# Altium schematic sheet InputSection.SchDoc: INPUT CAP,TVS, PI FILTER
size 420 x 297 mm; Revision: 1.0; SheetNumber: 2
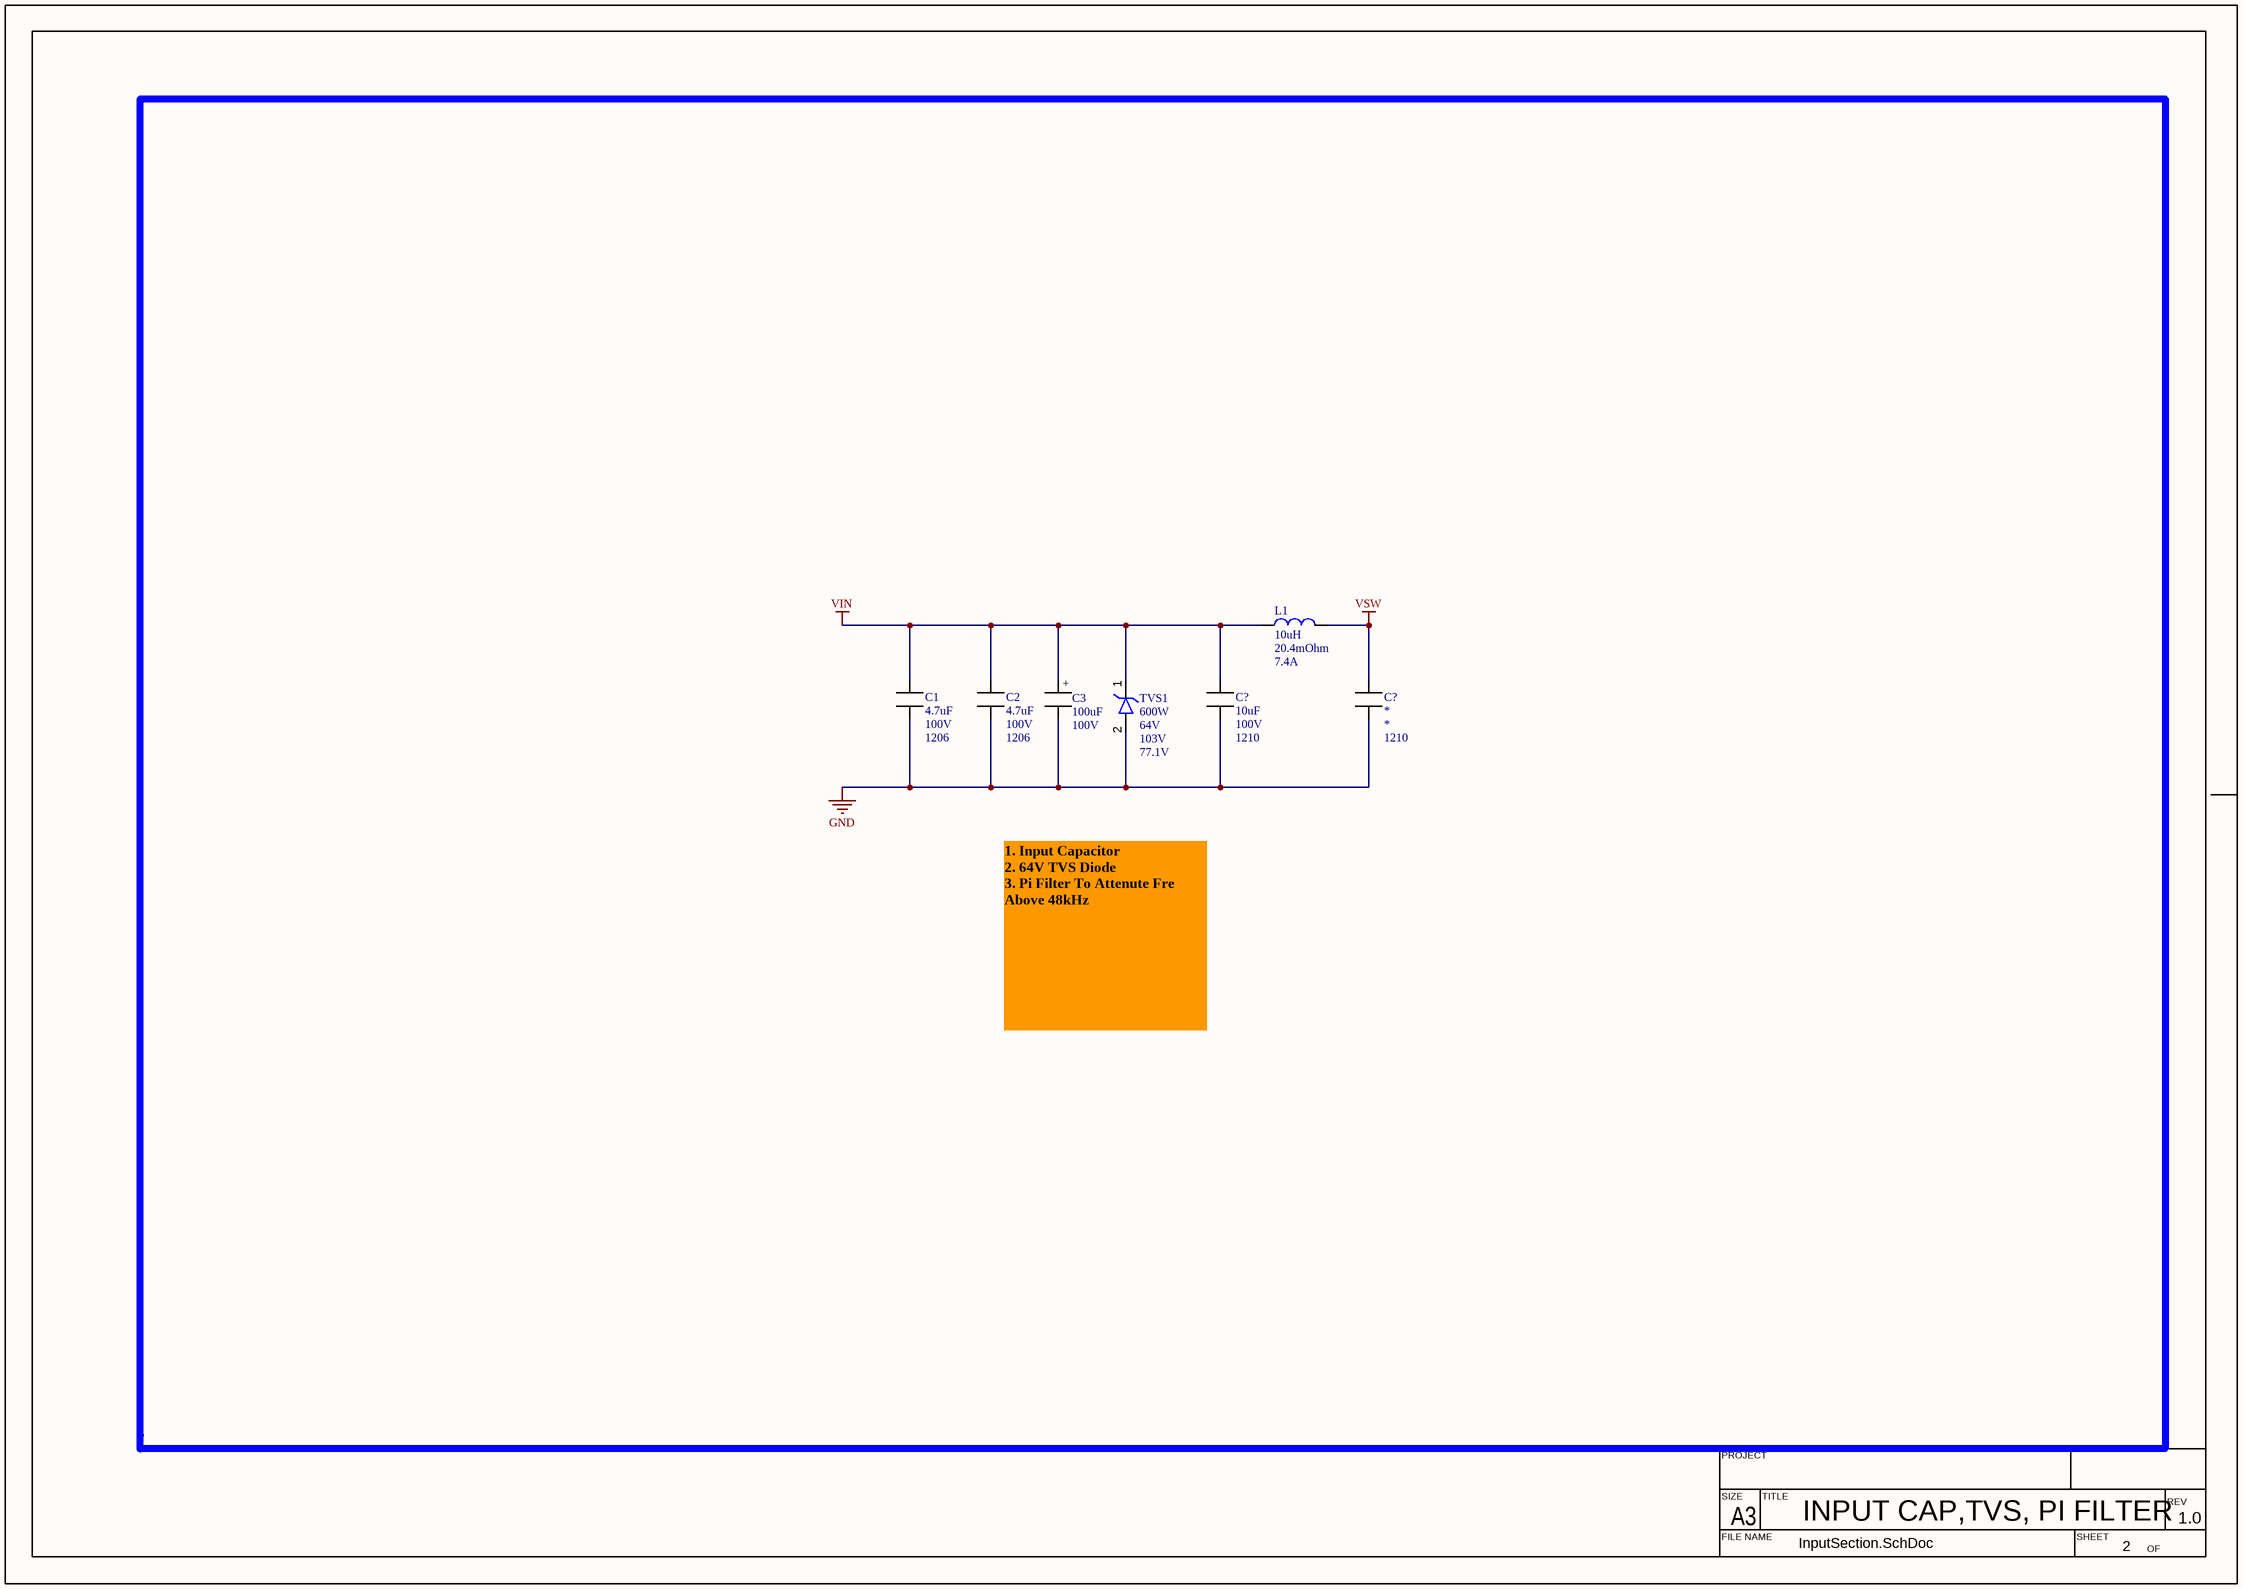
[diagram p0: InputSection.SchDoc]

## Parts
(Parts that share a designator on the sheet are numbered #1, #2 ... from top to bottom, then left to right.)
C1  value 4.7uF  Voltage: 100V  Package: 1206  [CAP1206]  (hidden comment: MLCC_1206)
C2  value 4.7uF  Voltage: 100V  Package: 1206  [CAP1206]  (hidden comment: MLCC_1206)
C3  value 100uF  Voltage: 100V  [CAP_12P5_13P5]  (hidden comment: CAP_12P5_13P5)
C?#1  value 10uF  Voltage: 100V  Package: 1210  [CAP1210]  (hidden comment: MLCC_1210)
C?#2  Package: 1210  [CAP1210]  (hidden comment: MLCC_1210)
L1  value 10uH  DCR: 20.4mOhm  ISAT: 7.4A  [XGL6060]  (hidden comment: XGL6060)
TVS1  PD: 600W  VRV: 64V  VCL: 103V  VBR: 77.1V  [SMBJ58A]  (hidden comment: SMBJ58A)

## Nets
GND: C1.2 C2.2 C3.2 C?#1.2 C?#2.2 TVS1.2(A)
VIN: C1.1 C2.1 C3.1 C?#1.1 L1.1 TVS1.1(K)
VSW: C?#2.1 L1.2

## Notes on the sheet
- 1. Input Capacitor
  2. 64V TVS Diode
  3. Pi Filter To Attenute Fre Above 48kHz
- PROJECT
- SIZE
- FILE NAME
- A3
- TITLE
- SHEET
- OF
- REV
- (in symbol CAP_12P5_13P5) +

## Library data of the parts
C1 C2 = MLCC_1206: MLCC 1206 (3216 Metric); Manufacturer 1: Murata Electronics; Manufacturer Part Number 1: GRM31CZ72A475KE11L
C3 = CAP_12P5_13P5: SMD,D12.5xL13.5mm  Aluminum Electrolytic Capacitors - SMD ROHS; Manufacturer 1: NCC(Nippon Chemi-Con); Manufacturer Part Number 1: EMVY101ARA101MKE0S; Package: 12.5X13.5
C?#1 C?#2 = MLCC_1210: MLCC 1210 (3225 Metric); Manufacturer 1: *; Manufacturer Part Number 1: *
  C?#2: Voltage: *; Value: *
L1 = XGL6060: Manufacturer Part Number 1: XGL6060-103MEC; Manufacturer 1: Coilcraft
TVS1 = SMBJ58A: TVS DIODE DO-214AA, SMB; Manufacturer Part Number 1: SMBJ64A; Manufacturer 1: *; Value: *